# EasyEDA Pro project mousring.eprj

# Schematic final
Board Name: c2; Create Date: 2025-06-27; Page Name: P1; Project Name: mousring; Schematic Name: final; Update Date: 2025-07-08; Company: EasyEDA.com; Page Size: A4; Version: V1.0
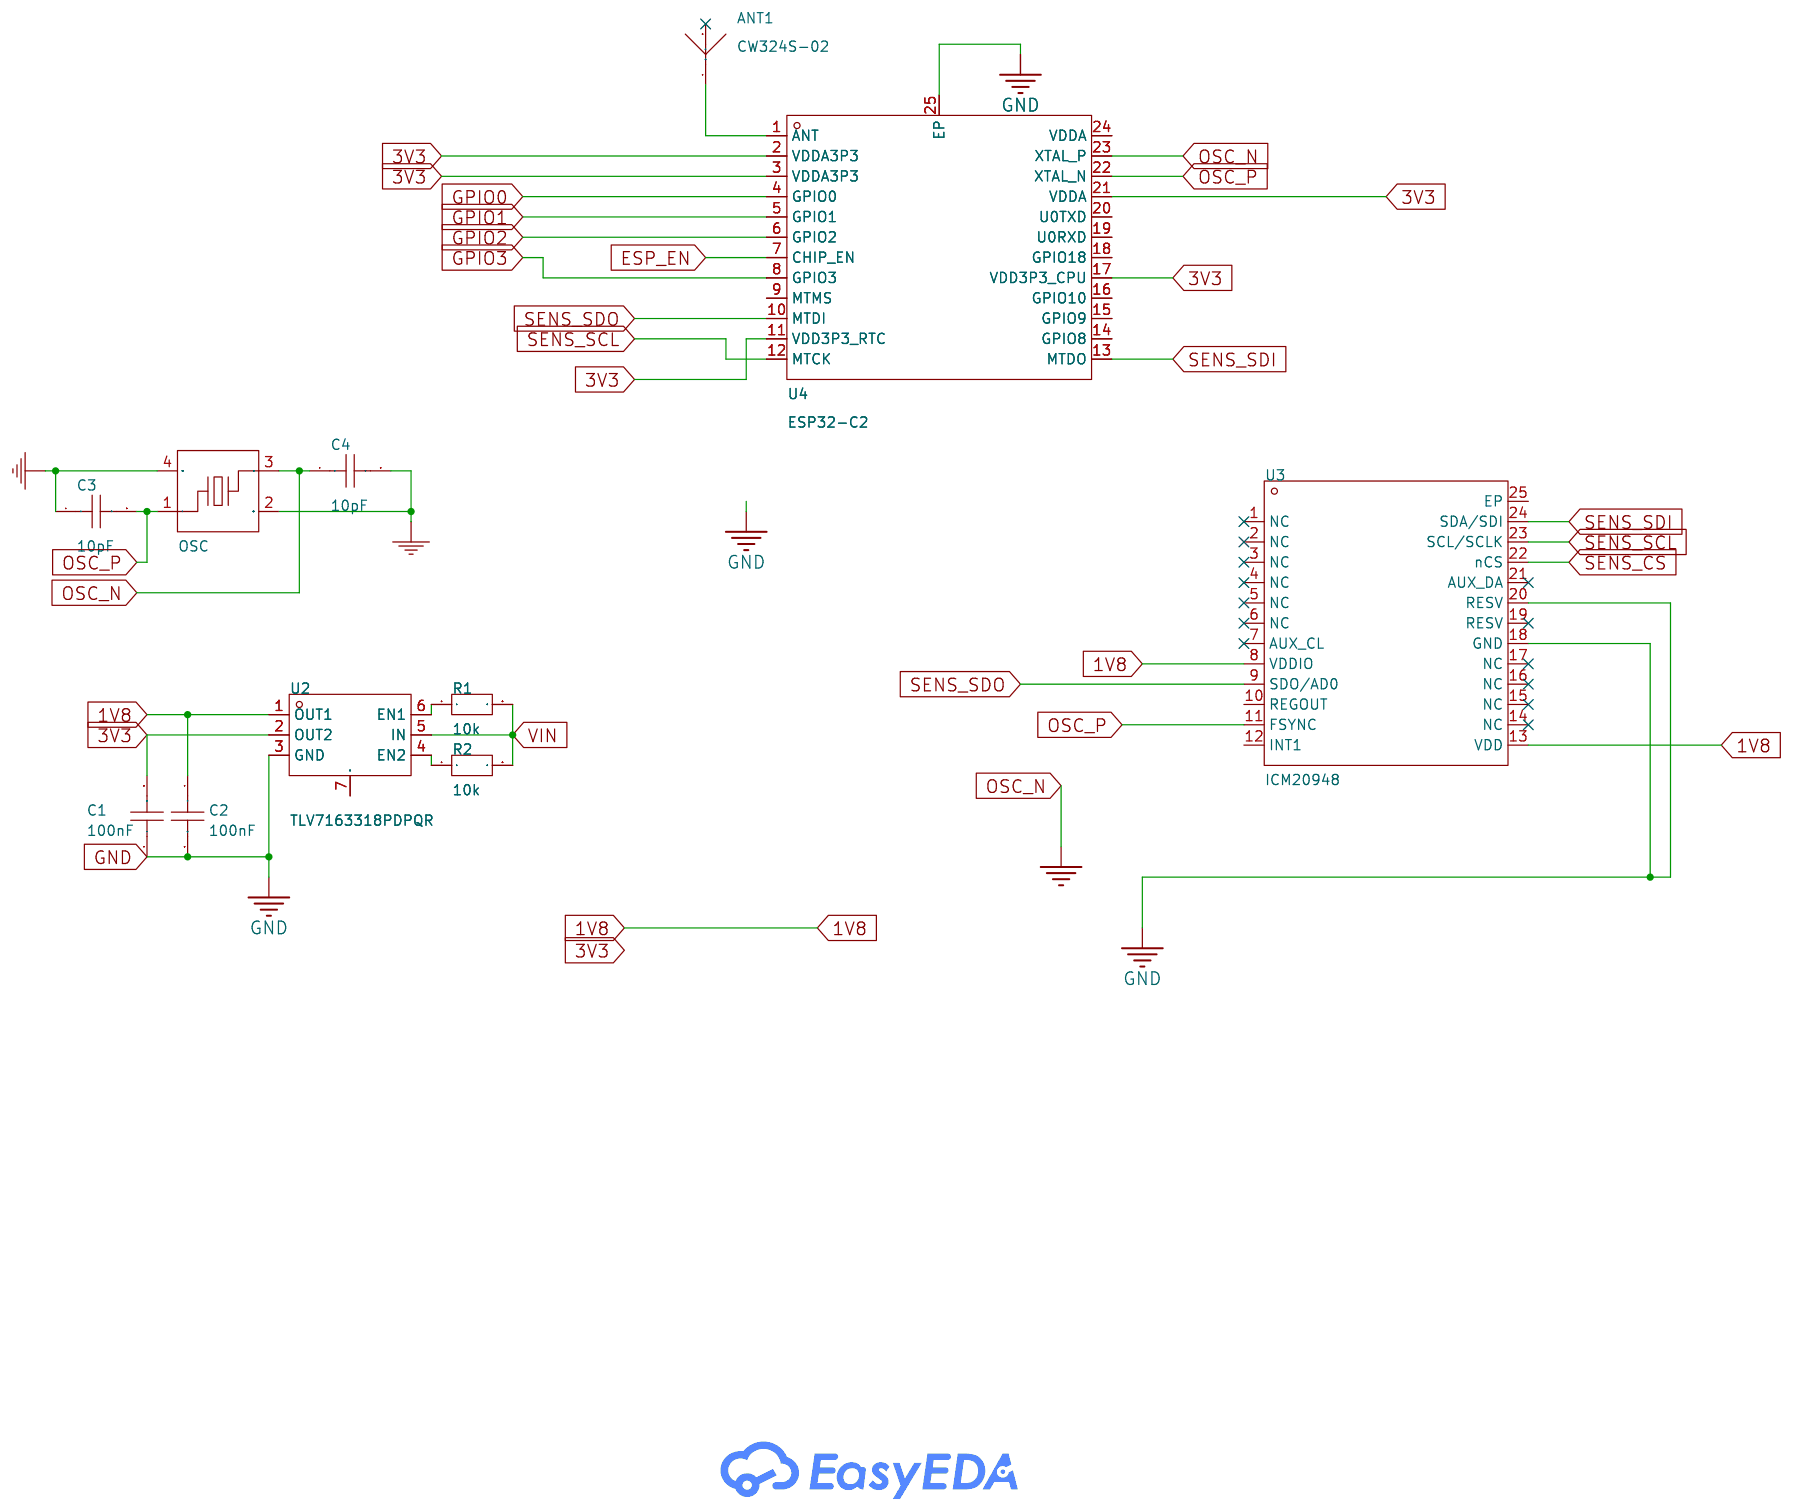
[diagram p0: schematic sheet]

## Parts
ANT1  CW324S-02  [ANT-SMD_L3.2-W1.6_CW324S-01]
C1  100nF  [C0201]
C2  100nF  [C0201]
C3  10pF  [C0201]
C4  10pF  [C0201]
R1  10k  [R0201]
R2  10k  [R0201]
U2  TLV7163318PDPQR  [XDFN-6_L1.2-W1.2-P0.40-BL-EP]
U3  ICM20948  [QFN-24_L3.0-W3.0-P0.40-BL-EP]
U4  ESP32-C2  [QFN-24_L4.0-W4.0-P0.50-BL-EP2.8]
X1  OSC  [CRYSTAL-SMD_4P-L1.6-W1.2-BL]

## Library data of the parts
ANT1 = CW324S-02: LCSC Part Name: LXC(连兴创)陶瓷SMT天线-CW324S; Supplier Part: C42379500; Manufacturer: LXC(连兴创); Datasheet: https://atta.szlcsc.com/upload/public/pdf/source/20241122/8212D1C9576862F7E470A8A9A6B7A996.pdf; Supplier: LCSC
C1-C4 = C0201X5R104K100NTA: LCSC Part Name: 100nF ±10% 10V; Supplier Part: C115574; Manufacturer: EYANG(宇阳科技); Supplier Footprint: 0201; JLCPCB Part Class: Extended Part; Datasheet: https://atta.szlcsc.com/upload/public/pdf/source/20190320/C377537_BBE5FC54ADCBA21EA65467531FECB98A.pdf; Supplier: LCSC; Tolerance: ±10%; Voltage Rating: 10V; Temperature Coefficient: X5R
R1 R2 = CRCW0201174KFKED: LCSC Part Name: 厚膜电阻 174kΩ ±1% 50mW; Supplier Part: C4009760; Manufacturer: VISHAY(威世); Supplier Footprint: 0201; JLCPCB Part Class: Extended Part; Datasheet: https://atta.szlcsc.com/upload/public/pdf/source/20231212/8E026970A8D15C23141671AA58BF5AA2.pdf; Supplier: LCSC; Type: Thick Film Resistor; Tolerance: ±1%; Power(Watts): 50mW; Temperature Coefficient: ±100ppm/℃; Operating Temperature: -55℃~+155℃
U2 = TLV7163318PDPQR: LCSC Part Name: 具有使能功能的 150mA、双通道低压降稳压器; Supplier Part: C2859836; Manufacturer: TI(德州仪器); Supplier Footprint: X2SON-6(1.2x1.2); JLCPCB Part Class: Extended Part; Datasheet: https://www.ti.com/cn/lit/gpn/tlv716p; Supplier: LCSC; Output Type: Fixed; Maximum Input Voltage: 5.5V; Output Voltage: 1.8V；3.3V; Output Current: 150mA; Dropout Voltage: 580mV@(150mA)；420mV@(150mA); standby current: 75uA; Feature: ESD Protection；Surge Protection；Automatic Discharge Function；Thermal Protection(TSD)；Under-voltage Lockout；Overcurrent Protection(OCP)；With ability；Anti-Siphon; Operating Temperature: -40℃~+125℃@(Tj); Output Polarity: Positive electrode; Number of Outputs: 2
U3 = ICM20948: Supplier Part: C2683596; Supplier Footprint: DFN-24-EP(3.0x3.0); JLCPCB Part Class: Extended Part; Supplier: LCSC
U4 = ESP32-C2: Supplier Part: C9900029065; Supplier Footprint: QFN24; Supplier: LCSC
X1 = 40MHz: Supplier: LCSC; Supplier Part: C7301927; Manufacturer: SCTF(星通时频); Manufacturer Part: SX0B40.000F1010F30; JLCPCB Part Class: Extended Part; nameAlias: Value; Contributor: lcsc; spicePre: X; spiceSymbolName: SX0B40.000F1010F30

## Nets
1V8: C2.1 U2.1(OUT1) U3.8(VDDIO) U3.13(VDD)
3V3: C1.2 U2.2(OUT2) U4.2(VDDA3P3) U4.3(VDDA3P3) U4.11(VDD3P3_RTC) U4.17(VDD3P3_CPU) U4.21(VDDA)
GND: C1.1 C2.2 C3.1 C4.2 U2.3(GND) U3.18(GND) U3.20(RESV) U4.25(EP) X1.2(GND) X1.4(GND)
VIN: R1.2 R2.2 U2.5(IN)
ESP_EN: U4.7(CHIP_EN)
GPIO0: U4.4(GPIO0)
GPIO1: U4.5(GPIO1)
GPIO2: U4.6(GPIO2)
GPIO3: U4.8(GPIO3)
OSC_N: C4.1 U4.23(XTAL_P) X1.3
OSC_P: C3.2 U3.11(FSYNC) U4.22(XTAL_N) X1.1
SENS_CS: U3.22(nCS)
SENS_SCL: U3.23(SCL/SCLK) U4.12(MTCK)
SENS_SDI: U3.24(SDA/SDI) U4.13(MTDO)
SENS_SDO: U3.9(SDO/AD0) U4.10(MTDI)
$1N3310: ANT1.1(ANT) U4.1(ANT)
$1N5722: R2.1 U2.4(EN2)
$1N5750: R1.1 U2.6(EN1)

Not connected (* = marked no-connect by the designer): ANT1 2*; U2 7(EP); U3 1(NC)* 2(NC)* 3(NC)* 4(NC)* 5(NC)* 6(NC)* 7(AUX_CL)* 10(REGOUT) 12(INT1) 14(NC)* 15(NC)* 16(NC)* 17(NC)* 19(RESV)* 21(AUX_DA)* 25(EP); U4 9(MTMS) 14(GPIO8) 15(GPIO9) 16(GPIO10) 18(GPIO18) 19(U0RXD) 20(U0TXD) 24(VDDA)

# Schematic ldo
Board Name: ldo; Create Date: 2025-06-27; Page Name: P1; Project Name: mousring; Schematic Name: ldo; Update Date: 2025-06-27; Company: EasyEDA.com; Page Size: A4; Version: V1.0
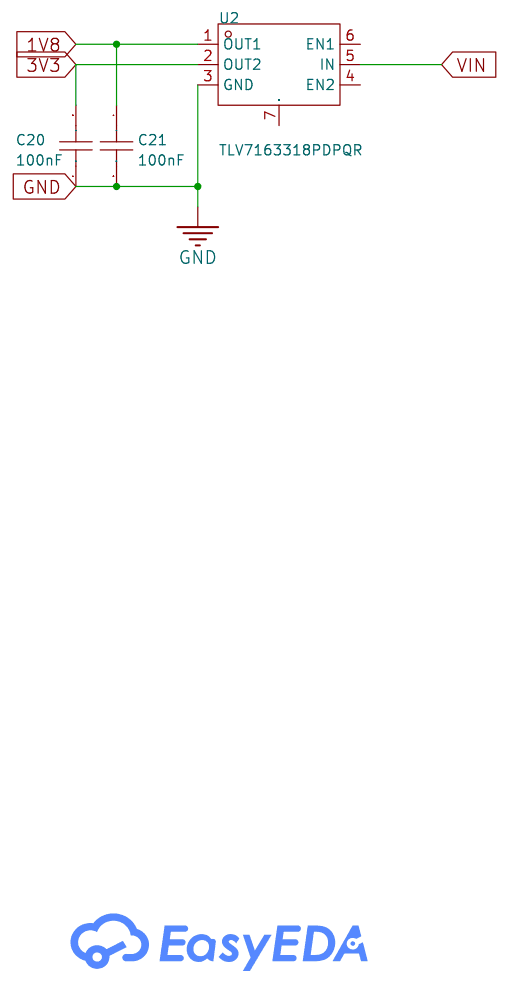
[diagram p1: schematic sheet]

## Parts
C20  100nF  [C0201]
C21  100nF  [C0201]
U2  TLV7163318PDPQR  [XDFN-6_L1.2-W1.2-P0.40-BL-EP]

## Library data of the parts
C20 C21 = C0201X5R104K100NTA: LCSC Part Name: 100nF ±10% 10V; Supplier Part: C115574; Manufacturer: EYANG(宇阳科技); Supplier Footprint: 0201; JLCPCB Part Class: Extended Part; Datasheet: https://atta.szlcsc.com/upload/public/pdf/source/20190320/C377537_BBE5FC54ADCBA21EA65467531FECB98A.pdf; Supplier: LCSC; Tolerance: ±10%; Voltage Rating: 10V; Temperature Coefficient: X5R
U2 = TLV7163318PDPQR: LCSC Part Name: 具有使能功能的 150mA、双通道低压降稳压器; Supplier Part: C2859836; Manufacturer: TI(德州仪器); Supplier Footprint: X2SON-6(1.2x1.2); JLCPCB Part Class: Extended Part; Datasheet: https://www.ti.com/cn/lit/gpn/tlv716p; Supplier: LCSC; Output Type: Fixed; Maximum Input Voltage: 5.5V; Output Voltage: 1.8V；3.3V; Output Current: 150mA; Dropout Voltage: 580mV@(150mA)；420mV@(150mA); standby current: 75uA; Feature: ESD Protection；Surge Protection；Automatic Discharge Function；Thermal Protection(TSD)；Under-voltage Lockout；Overcurrent Protection(OCP)；With ability；Anti-Siphon; Operating Temperature: -40℃~+125℃@(Tj); Output Polarity: Positive electrode; Number of Outputs: 2

## Nets
1V8: C21.1 U2.1(OUT1)
3V3: C20.2 U2.2(OUT2)
GND: C20.1 C21.2 U2.3(GND)
VIN: U2.5(IN)

Not connected (* = marked no-connect by the designer): U2 4(EN2) 6(EN1) 7(EP)

# Schematic h4
Board Name: h4; Create Date: 2025-07-08; Page Name: h4; Project Name: mousring; Schematic Name: h4; Update Date: 2025-07-26; Company: EasyEDA.com; Page Size: A4; Version: V1.0
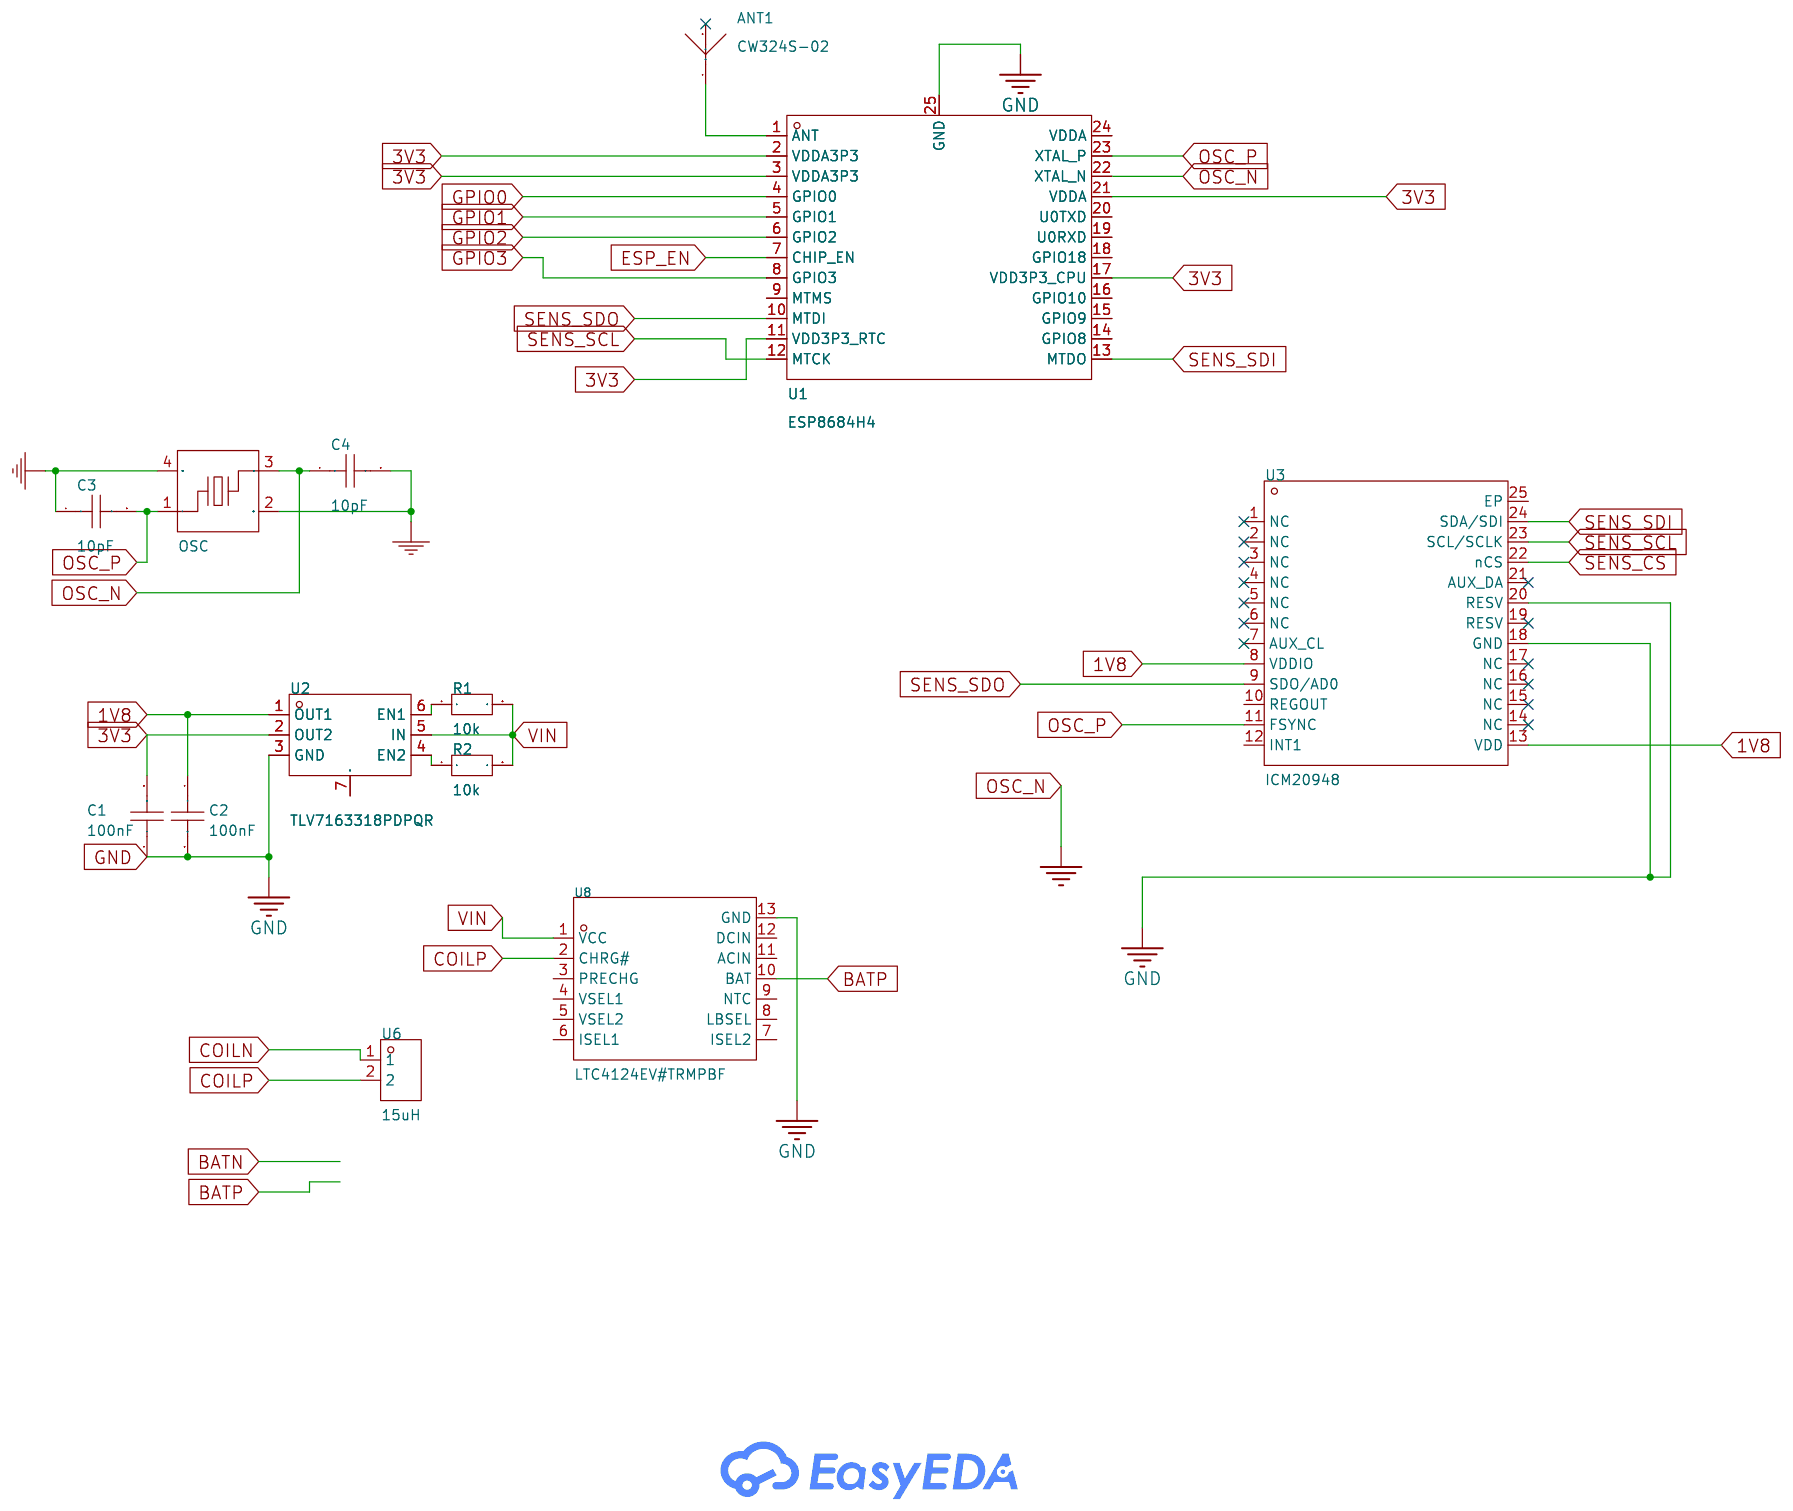
[diagram p2: schematic sheet]

## Parts
ANT1  CW324S-02  [ANT-SMD_L3.2-W1.6_CW324S-01]
C1  100nF  [C0201]
C2  100nF  [C0201]
C3  10pF  [C0201]
C4  10pF  [C0201]
R1  10k  [R0201]
R2  10k  [R0201]
U1  ESP8684H4  [QFN-24_L4.0-W4.0-P0.50-TL-EP2.8]
U2  TLV7163318PDPQR  [XDFN-6_L1.2-W1.2-P0.40-BL-EP]
U3  ICM20948  [QFN-24_L3.0-W3.0-P0.40-BL-EP]
U6  15uH  [newcoil]
U8  LTC4124EV#TRMPBF  [LQFN-12_L2.0-W2.0-P0.50-TL-EP0.7-1]
X1  OSC  [CRYSTAL-SMD_4P-L1.6-W1.2-BL]

## Library data of the parts
ANT1 = CW324S-02: LCSC Part Name: LXC(连兴创)陶瓷SMT天线-CW324S; Supplier Part: C42379500; Manufacturer: LXC(连兴创); Datasheet: https://atta.szlcsc.com/upload/public/pdf/source/20241122/8212D1C9576862F7E470A8A9A6B7A996.pdf; Supplier: LCSC
C1-C4 = C0201X5R104K100NTA: LCSC Part Name: 100nF ±10% 10V; Supplier Part: C115574; Manufacturer: EYANG(宇阳科技); Supplier Footprint: 0201; JLCPCB Part Class: Extended Part; Datasheet: https://atta.szlcsc.com/upload/public/pdf/source/20190320/C377537_BBE5FC54ADCBA21EA65467531FECB98A.pdf; Supplier: LCSC; Tolerance: ±10%; Voltage Rating: 10V; Temperature Coefficient: X5R
R1 R2 = CRCW0201174KFKED: LCSC Part Name: 厚膜电阻 174kΩ ±1% 50mW; Supplier Part: C4009760; Manufacturer: VISHAY(威世); Supplier Footprint: 0201; JLCPCB Part Class: Extended Part; Datasheet: https://atta.szlcsc.com/upload/public/pdf/source/20231212/8E026970A8D15C23141671AA58BF5AA2.pdf; Supplier: LCSC; Type: Thick Film Resistor; Tolerance: ±1%; Power(Watts): 50mW; Temperature Coefficient: ±100ppm/℃; Operating Temperature: -55℃~+155℃
U1 = ESP8684H4: Frequency Range:2.412GHz~2.484GHz Frequency Range:2.412GHz~2.484GHz Interface:ADC；SPI；I2C；PWM；UART Voltage - Supply:3V~3.6V Voltage - Supply:3V~3.6V Applications:WiFi；Bluetooth Output Power:21.5dBm Data Rate:72.2Mbps Current Of Transmitting:370mA Sensitiv; Supplier Part: C3013914; Manufacturer: ESPRESSIF(乐鑫); Supplier Footprint: SMD; JLCPCB Part Class: Extended Part; Datasheet: https://atta.szlcsc.com/upload/public/pdf/source/20241030/0403F47588ED3144E213BDA8AAC70CC1.pdf; Supplier: LCSC; Frequency Range: 2.412GHz~2.484GHz; Interface: ADC；SPI；I2C；PWM；UART; Voltage - Supply: 3V~3.6V; Applications: WiFi；Bluetooth; Output Power: 21.5dBm; Data Rate: 72.2Mbps; Current Of Transmitting: 370mA; Sensitivity: -99dBm; Receive Current: 65mA; Typical Application Frequency: 2.4GHz; Operating Temperature: -40℃~+105℃
U2 = TLV7163318PDPQR: LCSC Part Name: 具有使能功能的 150mA、双通道低压降稳压器; Supplier Part: C2859836; Manufacturer: TI(德州仪器); Supplier Footprint: X2SON-6(1.2x1.2); JLCPCB Part Class: Extended Part; Datasheet: https://www.ti.com/cn/lit/gpn/tlv716p; Supplier: LCSC; Output Type: Fixed; Maximum Input Voltage: 5.5V; Output Voltage: 1.8V；3.3V; Output Current: 150mA; Dropout Voltage: 580mV@(150mA)；420mV@(150mA); standby current: 75uA; Feature: ESD Protection；Surge Protection；Automatic Discharge Function；Thermal Protection(TSD)；Under-voltage Lockout；Overcurrent Protection(OCP)；With ability；Anti-Siphon; Operating Temperature: -40℃~+125℃@(Tj); Output Polarity: Positive electrode; Number of Outputs: 2
U3 = ICM20948: Supplier Part: C2683596; Supplier Footprint: DFN-24-EP(3.0x3.0); JLCPCB Part Class: Extended Part; Supplier: LCSC
U6 = YX-A11-R500800-R0890: Supplier Part: C3003210; Manufacturer: CND-tek(磁联达); JLCPCB Part Class: Extended Part; Datasheet: https://atta.szlcsc.com/upload/public/pdf/source/20220506/4D0CC8BB7166D52E801353293D8C1412.pdf; Supplier: LCSC; Function: Transmitter; Tolerance: ±10%; Number of Coils: Single coil, single layer; Operating Temperature: -40℃~+85℃
U8 = LTC4124EV#TRMPBF: LCSC Part Name: 100mA 无线锂离子充电器带低电量断开功能; Supplier Part: C3682877; Manufacturer: ADI(亚德诺); Supplier Footprint: LQFN-12(2x2); JLCPCB Part Class: Extended Part; Datasheet: https://atta.szlcsc.com/upload/public/pdf/source/20231009/7EC994927F1848793EB29D91CD0599CA.pdf; Supplier: LCSC; The Chip Type: Charging IC; Voltage - Supply: 2.7V~5.5V; Charge Current - Max: 100mA; Charging Saturation Voltage: 4.35V; End-Off Voltage: 2.7V; Type of Battery: Lithium Battery; Number of Cells: 1; Operating Temperature: -20℃~+85℃; Battery Temperature Detection: Support; 0V Battery Charge: Not Supported; Supply Current (Iq): 120uA
X1 = 40MHz: Supplier: LCSC; Supplier Part: C7301927; Manufacturer: SCTF(星通时频); Manufacturer Part: SX0B40.000F1010F30; JLCPCB Part Class: Extended Part; nameAlias: Value; Contributor: lcsc; spicePre: X; spiceSymbolName: SX0B40.000F1010F30

## Nets
1V8: C2.1 U2.1(OUT1) U3.8(VDDIO) U3.13(VDD)
3V3: C1.2 U1.2(VDDA3P3) U1.3(VDDA3P3) U1.11(VDD3P3_RTC) U1.17(VDD3P3_CPU) U1.21(VDDA) U2.2(OUT2)
GND: C1.1 C2.2 C3.1 C4.2 U1.25(GND) U2.3(GND) U3.18(GND) U3.20(RESV) U8.13(GND) X1.2(GND) X1.4(GND)
VIN: R1.2 R2.2 U2.5(IN) U8.1(VCC)
BATP: U8.10(BAT)
COILN: U6.1
COILP: U6.2 U8.2(CHRG#)
ESP_EN: U1.7(CHIP_EN)
GPIO0: U1.4(GPIO0)
GPIO1: U1.5(GPIO1)
GPIO2: U1.6(GPIO2)
GPIO3: U1.8(GPIO3)
OSC_N: C4.1 U1.22(XTAL_N) X1.3
OSC_P: C3.2 U1.23(XTAL_P) U3.11(FSYNC) X1.1
SENS_CS: U3.22(nCS)
SENS_SCL: U1.12(MTCK) U3.23(SCL/SCLK)
SENS_SDI: U1.13(MTDO) U3.24(SDA/SDI)
SENS_SDO: U1.10(MTDI) U3.9(SDO/AD0)
$1N3310: ANT1.1(ANT) U1.1(ANT)
$1N5722: R2.1 U2.4(EN2)
$1N5750: R1.1 U2.6(EN1)

Not connected (* = marked no-connect by the designer): ANT1 2*; U1 9(MTMS) 14(GPIO8) 15(GPIO9) 16(GPIO10) 18(GPIO18) 19(U0RXD) 20(U0TXD) 24(VDDA); U2 7(EP); U3 1(NC)* 2(NC)* 3(NC)* 4(NC)* 5(NC)* 6(NC)* 7(AUX_CL)* 10(REGOUT) 12(INT1) 14(NC)* 15(NC)* 16(NC)* 17(NC)* 19(RESV)* 21(AUX_DA)* 25(EP); U8 3(PRECHG) 4(VSEL1) 5(VSEL2) 6(ISEL1) 7(ISEL2) 8(LBSEL) 9(NTC) 11(ACIN) 12(DCIN)

# Board PCB8
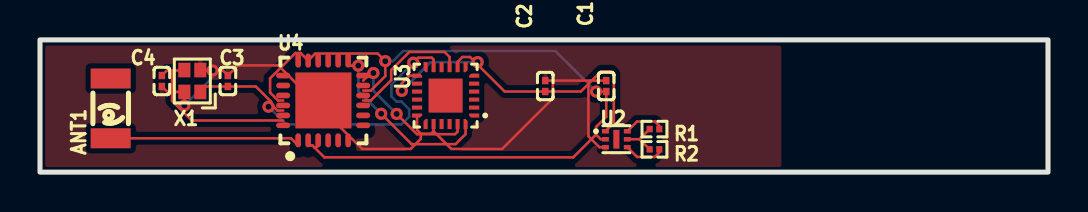
[diagram p3: board, top side]
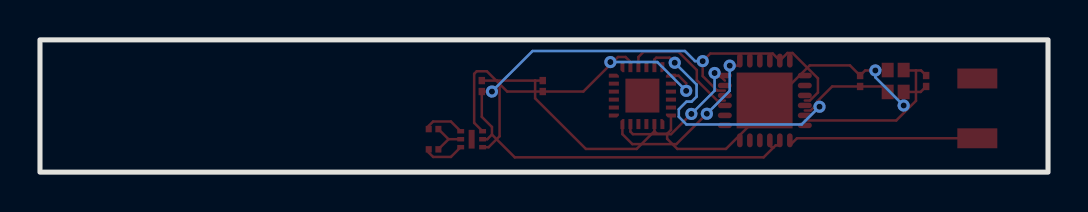
[diagram p4: board, bottom side, seen from below]

Outline 50.42 x 6.64 mm; copper layers: Top Layer, Bottom Layer. Coordinates in mm from the lower left corner of the outline.
Outline path: rectangle 0,0 50.42,6.64
Stack: Top Layer 0.012mm / Dielectric1 0.025mm FR4 er 4.5 / Bottom Layer 0.012mm

## Design rules (mm)
template: Custom Config
spacing copperThickness1oz (default): track to track 0.102, other pairs 0.152 to 0.3
spacing copperThickness2oz: track to track 0.203, other pairs 0.152 to 0.3
track width copperThickness1oz (default): min 0.127, default 0.127, max 2.54
track width copperThickness2oz: min 0.203, default 0.254, max 2.54
differential pair differentialPair (default): width min 0.127, default 0.254, max 2.54; gap min 0.152, default 0.152
via viaSize (default): diameter min 0.5, default 0.61, max 10; hole min 0.3, default 0.305, max 6.3

## Placement (name value [footprint] x y rotation side)
ANT1  CW324S-02  [ANT-SMD_L3.2-W1.6_CW324S-01]  3.54 3.2 90 top
C1  100nF  [C0201]  28.32 4.32 270 top
C2  100nF  [C0201]  25.27 4.32 90 top
C3  10pF  [C0201]  9.4 4.57 270 top
C4  10pF  [C0201]  6.1 4.57 270 top
R1  10k  [R0201]  30.73 2.16 180 top
R2  10k  [R0201]  30.73 1.14 180 top
U2  TLV7163318PDPQR  [XDFN-6_L1.2-W1.2-P0.40-BL-EP]  28.83 1.65 270 top
U3  ICM20948  [QFN-24_L3.0-W3.0-P0.40-BL-EP]  20.29 3.84 90 top
U4  ESP32-C2  [QFN-24_L4.0-W4.0-P0.50-BL-EP2.8]  14.16 3.6 0 top
X1  OSC  [CRYSTAL-SMD_4P-L1.6-W1.2-BL]  7.62 4.57 90 top

## Footprints (pads in the part's own frame, mm; a bottom-side part is the same pattern mirrored in y, then rotated)
ANT-SMD_L3.2-W1.6_CW324S-01
  rect 1x2 smd: 1(-1.5,0) 2(1.5,0)
C0201
  rect 0.368x0.324 smd: 1(-0.275,0) 2(0.275,0)
CRYSTAL-SMD_4P-L1.6-W1.2-BL
  rect 0.73x0.6 smd: 1(-0.55,-0.4) 2(0.55,-0.4) 3(0.55,0.4) 4(-0.55,0.4)
QFN-24_L3.0-W3.0-P0.40-BL-EP
  custom 0.2x0.506 smd: 1(-1,-1.427) 6(1,-1.427) 13(1,1.427) 18(-1,1.427)
  rect 0.2x0.505 smd: 2(-0.6,-1.427) 3(-0.2,-1.427) 4(0.2,-1.427) 5(0.6,-1.427) 14(0.6,1.427) 15(0.2,1.427) 16(-0.2,1.427) 17(-0.6,1.427)
  custom 0.506x0.2 smd: 7(1.427,-1) 12(1.427,1) 19(-1.427,1) 24(-1.427,-1)
  rect 0.505x0.2 smd: 8(1.427,-0.6) 9(1.427,-0.2) 10(1.427,0.2) 11(1.427,0.6) 20(-1.427,0.6) 21(-1.427,0.2) 22(-1.427,-0.2) 23(-1.427,-0.6)
  rect 1.7x1.7 smd: 25(0,0)
QFN-24_L4.0-W4.0-P0.50-BL-EP2.8
  oval 0.28x0.7 smd: 1(-1.25,-2) 2(-0.75,-2) 3(-0.25,-2) 4(0.25,-2) 5(0.75,-2) 6(1.25,-2) 13(1.25,2) 14(0.75,2) 15(0.25,2) 16(-0.25,2) 17(-0.75,2) 18(-1.25,2)
  oval 0.7x0.28 smd: 7(2,-1.25) 8(2,-0.75) 9(2,-0.25) 10(2,0.25) 11(2,0.75) 12(2,1.25) 19(-2,1.25) 20(-2,0.75) 21(-2,0.25) 22(-2,-0.25) 23(-2,-0.75) 24(-2,-1.25)
  rect 2.8x2.8 smd: 25(0.013,0)
R0201
  rect 0.303x0.324 smd: 1(-0.241,0) 2(0.241,0)
XDFN-6_L1.2-W1.2-P0.40-BL-EP
  rect 0.224x0.345 smd: 1(-0.4,-0.547) 2(0,-0.547) 3(0.4,-0.547) 4(0.4,0.547) 5(0,0.547) 6(-0.4,0.547)
  rect 0.94x0.3 smd: 7(0,0)

## Nets
As in the schematic.

Pads without a net: ANT1 2; U2 7; U3 1 2 3 4 5 6 7 10 12 14 15 16 17 19 21 25; U4 9 14 15 16 18 19 20 24

## Via types
v1: diameter 0.61, hole 0.305, Top Layer to Bottom Layer, 12 vias

## Routing (per net, layer and track width the routed paths; a pad name or vN(x,y) marks a point on that pad's centre or on a via; arc(x,y) is an arc through that point)
1V8: length 18.2
  Top Layer w0.127: 21.76,5.52 v1(21.89,5.52) ; 21.76,5.52 21.51,5.78 21.13,5.78 20.89,5.53 U3.8 ; 21.76,5.52 23.24,4.04 C2.1 27.05,4.04 28.07,5.06 28.57,5.06 28.7,4.93 28.7,2.47 U2.1 ; U3.13 18.48,4.84 18.1,4.46 v1(18.1,4.08)
  Bottom Layer w0.127: v1(18.1,4.08) 19.54,5.52 v1(21.89,5.52)
3V3: length 41.1
  Top Layer w0.127: U4.17 13.03,5.98 12.78,5.98 11.51,4.71 11.51,3.99 11.91,3.59 12.16,3.59 ; U4.17 13.41,5.34 ; U4.17 13.77,5.95 16.89,5.95 v1(17.27,5.57) 17.27,4.82 16.54,4.09 16.16,4.09 ; 13.91,1.34 13.82,1.25 13.72,1.25 ; v1(27.81,4.04) C1.2 28.32,2.77 27.81,2.27 27.81,1.88 ; 13.41,1.34 13.62,1.34 13.72,1.25 ; 13.72,1.25 14.22,0.74 26.67,0.74 27.81,1.88 ; 27.81,1.88 28.05,1.65 U2.2
  Bottom Layer w0.127: v1(17.27,5.57) 17.65,5.57 18.16,6.08 25.78,6.08 v1(27.81,4.04)
GND: length 35.1
  Top Layer w0.127: 27.56,4.59 27.43,4.47 27.43,1.8 27.98,1.25 U2.3 ; 27.56,4.59 C1.1 ; 27.56,4.59 25.65,4.59 ; 25.65,4.59 C2.2 ; 25.65,4.59 25.65,3.7 23.11,1.16 20.57,1.16 19.69,2.05 ; C4.2 6.37,4.02 X1.4 v1(7.22,3.34) ; X1.2 8.04,5.1 v1(8.64,5.1) 9.14,5.1 C3.1 9.91,5.35 11.92,5.35 16.11,1.16 18.54,1.16 19.05,1.67 19.05,1.93 ; 19.05,1.93 18.86,2.11 U3.18 ; 19.05,1.93 19.56,1.93 19.69,2.05 ; 19.69,2.05 19.69,2.41
  Bottom Layer w0.127: v1(8.64,5.1) 8.64,4.76 v1(7.22,3.34)
VIN: length 2
  Top Layer w0.127: 29.98,1.65 R2.2 ; 29.98,1.65 U2.5 ; 29.98,1.65 R1.2
OSC_N: length 8.7
  Top Layer w0.127: 12.16,2.59 7.59,2.59 6.6,3.58 6.6,5.1 ; 6.6,5.1 6.35,5.1 C4.1 ; 6.6,5.1 7.2,5.1 X1.3
OSC_P: length 17.8
  Top Layer w0.127: v1(18.67,5.49) 18.93,5.74 19.59,5.74 19.69,5.65 U3.11 ; X1.1 8.3,4.3 C3.2 10.79,4.3 11.56,3.54 11.56,3.41 ; 11.56,3.41 11.87,3.09 12.16,3.09 ; 11.56,3.41 v1(11.43,3.28)
  Bottom Layer w0.127: v1(18.67,5.49) 17.58,4.39 17.58,3.79 17.83,3.54 18.08,3.54 18.46,3.15 18.46,2.77 18.08,2.39 12.32,2.39 v1(11.43,3.28)
SENS_SCL: length 7.1
  Top Layer w0.127: 16.16,4.59 16.54,4.97 v1(16.68,4.97) ; v1(17.84,2.92) 18.86,1.9 20.76,1.9 20.89,2.03 U3.23
  Bottom Layer w0.127: v1(17.84,2.92) 16.68,4.08 v1(16.68,4.97)
SENS_SDI: length 9
  Top Layer w0.127: v1(17.06,2.93) 18.59,1.4 20.79,1.4 21.29,1.9 U3.24 ; 15.41,5.34 v1(15.92,5.34)
  Bottom Layer w0.127: v1(15.92,5.34) 15.92,4.07 v1(17.06,2.93)
SENS_SDO: length 6.2
  Top Layer w0.127: U3.9 20.49,5.78 20.23,6.03 18.47,6.03 17.57,5.12 17.57,4.61 16.54,3.59 16.16,3.59
$1N3310: length 9.5
  Top Layer w0.127: 12.91,1.34 12.56,1.7 ANT1.1
$1N5722: length 2.1
  Top Layer w0.127: R2.1 30.98,0.98 30.75,0.76 29.87,0.76 U2.4
$1N5750: length 2.1
  Top Layer w0.127: R1.1 30.98,2.32 30.75,2.54 29.87,2.54 U2.6

## Copper pours and planes (outline as drawn; the poured copper is in the pictures)
GND on Top Layer: 0.25,6.35 37.08,6.35 37.08,0.25 0.25,0.25

# Board PCB8_1
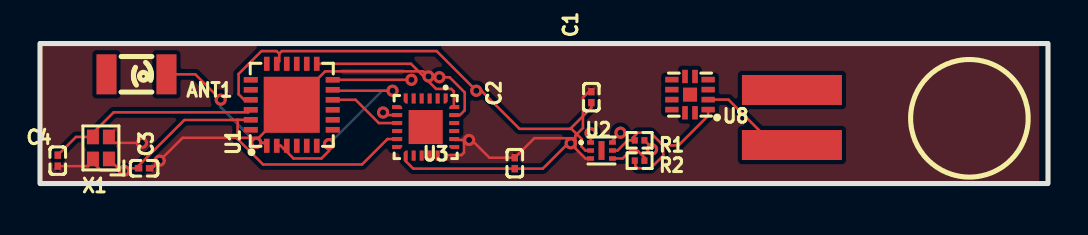
[diagram p5: board, top side]
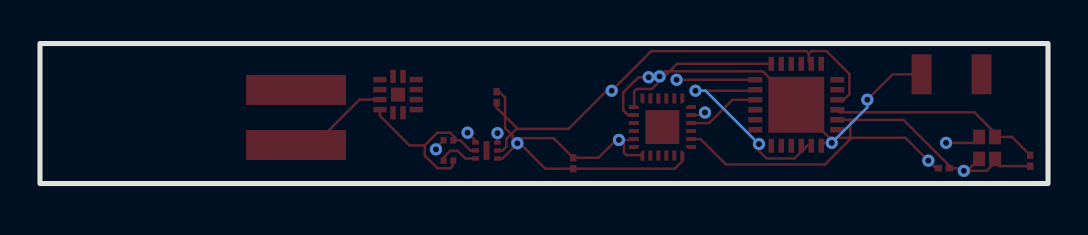
[diagram p6: board, bottom side, seen from below]

Outline 50.42 x 7 mm; copper layers: Top Layer, Inner1, Inner2, Bottom Layer. Coordinates in mm from the lower left corner of the outline.
Outline path: rectangle 0,0 50.42,7
Stack: Top Layer 0.035mm / Dielectric1 0.48mm PP er 4.5 / Inner1 0.035mm / Dielectric2 0.48mm FR4 er 4.5 / Inner2 0.035mm / Dielectric3 0.48mm PP er 4.5 / Bottom Layer 0.035mm

## Design rules (mm)
template: Custom Config
spacing copperThickness1oz (default): track to track 0.102, other pairs 0.152 to 0.3
spacing copperThickness2oz: track to track 0.203, other pairs 0.152 to 0.3
track width copperThickness1oz (default): min 0.127, default 0.127, max 2.54
track width copperThickness2oz: min 0.203, default 0.254, max 2.54
differential pair differentialPair (default): width min 0.127, default 0.254, max 2.54; gap min 0.152, default 0.152
via viaSize (default): diameter min 0.5, default 0.61, max 10; hole min 0.3, default 0.305, max 6.3
net GND uses copperRegion1

## Placement (name value [footprint] x y rotation side)
ANT1  CW324S-02  [ANT-SMD_L3.2-W1.6_CW324S-01]  4.83 5.46 180 top
C1  100nF  [C0201]  27.58 4.32 270 top
C2  100nF  [C0201]  23.75 1.02 90 top
C3  10pF  [C0201]  5.21 0.76 180 top
C4  10pF  [C0201]  0.89 1.14 270 top
R1  10k  [R0201]  29.99 2.16 180 top
R2  10k  [R0201]  29.99 1.14 180 top
U1  ESP8684H4  [QFN-24_L4.0-W4.0-P0.50-TL-EP2.8]  12.59 3.94 90 top
U2  TLV7163318PDPQR  [XDFN-6_L1.2-W1.2-P0.40-BL-EP]  28.09 1.65 270 top
U3  ICM20948  [QFN-24_L3.0-W3.0-P0.40-BL-EP]  19.29 2.82 180 top
U6  15uH  [newcoil]  42.16 3.3 270 top
U8  LTC4124EV#TRMPBF  [LQFN-12_L2.0-W2.0-P0.50-TL-EP0.7-1]  32.51 4.45 180 top
X1  OSC  [CRYSTAL-SMD_4P-L1.6-W1.2-BL]  3.05 1.78 90 top

## Footprints (pads in the part's own frame, mm; a bottom-side part is the same pattern mirrored in y, then rotated)
ANT-SMD_L3.2-W1.6_CW324S-01
  rect 1x2 smd: 1(-1.5,0) 2(1.5,0)
C0201
  rect 0.368x0.324 smd: 1(-0.275,0) 2(0.275,0)
CRYSTAL-SMD_4P-L1.6-W1.2-BL
  rect 0.73x0.6 smd: 1(-0.55,-0.4) 2(0.55,-0.4) 3(0.55,0.4) 4(-0.55,0.4)
LQFN-12_L2.0-W2.0-P0.50-TL-EP0.7-1
  rect 0.665x0.28 smd: 1(-0.907,0.75) 2(-0.907,0.25) 3(-0.907,-0.25) 4(-0.907,-0.75) 7(0.907,-0.75) 8(0.907,-0.25) 9(0.907,0.25) 10(0.907,0.75)
  rect 0.28x0.665 smd: 5(-0.25,-0.907) 6(0.25,-0.907) 11(0.25,0.907) 12(-0.25,0.907)
  rect 0.7x0.7 smd: 13(0,0)
newcoil
  rect 1.5x5 smd: 1(-1.375,-4.554) 2(1.377,-4.555)
QFN-24_L3.0-W3.0-P0.40-BL-EP
  custom 0.2x0.506 smd: 1(-1,-1.427) 6(1,-1.427) 13(1,1.427) 18(-1,1.427)
  rect 0.2x0.505 smd: 2(-0.6,-1.427) 3(-0.2,-1.427) 4(0.2,-1.427) 5(0.6,-1.427) 14(0.6,1.427) 15(0.2,1.427) 16(-0.2,1.427) 17(-0.6,1.427)
  custom 0.506x0.2 smd: 7(1.427,-1) 12(1.427,1) 19(-1.427,1) 24(-1.427,-1)
  rect 0.505x0.2 smd: 8(1.427,-0.6) 9(1.427,-0.2) 10(1.427,0.2) 11(1.427,0.6) 20(-1.427,0.6) 21(-1.427,0.2) 22(-1.427,-0.2) 23(-1.427,-0.6)
  rect 1.7x1.7 smd: 25(0,0)
QFN-24_L4.0-W4.0-P0.50-TL-EP2.8
  rect 0.7x0.28 smd: 1(-2.05,1.25) 2(-2.05,0.75) 3(-2.05,0.25) 4(-2.05,-0.25) 5(-2.05,-0.75) 6(-2.05,-1.25) 13(2.05,-1.25) 14(2.05,-0.75) 15(2.05,-0.25) 16(2.05,0.25) 17(2.05,0.75) 18(2.05,1.25)
  rect 0.28x0.7 smd: 7(-1.25,-2.05) 8(-0.75,-2.05) 9(-0.25,-2.05) 10(0.25,-2.05) 11(0.75,-2.05) 12(1.25,-2.05) 19(1.25,2.05) 20(0.75,2.05) 21(0.25,2.05) 22(-0.25,2.05) 23(-0.75,2.05) 24(-1.25,2.05)
  rect 2.8x2.8 smd: 25(0,0)
R0201
  rect 0.303x0.324 smd: 1(-0.241,0) 2(0.241,0)
XDFN-6_L1.2-W1.2-P0.40-BL-EP
  rect 0.224x0.345 smd: 1(-0.4,-0.547) 2(0,-0.547) 3(0.4,-0.547) 4(0.4,0.547) 5(0,0.547) 6(-0.4,0.547)
  rect 0.94x0.3 smd: 7(0,0)

## Nets
As in the schematic.

Pads without a net: ANT1 2; U1 9 14 15 16 18 19 20 24; U2 7; U3 1 2 3 4 5 6 7 10 12 14 15 16 17 19 21 25; U8 3 4 5 6 7 8 9 11 12

## Via types
v1: diameter 0.61, hole 0.305, Top Layer to Bottom Layer, 17 vias

## Routing (per net, layer and track width the routed paths; a pad name or vN(x,y) marks a point on that pad's centre or on a via; arc(x,y) is an arc through that point)
1V8: length 21.7
  Top Layer w0.127: v1(27.54,2.52) U2.1 ; U3.13 18.29,1.12 18.67,0.74 C2.1 25.15,0.74 26.42,2.01 v1(26.54,2.01) ; U3.8 17.29,3.42 v1(17.16,3.55)
  Inner1 w0.127: v1(27.54,2.52) 27.03,2.01 v1(26.54,2.01)
  Inner2 w0.127: v1(17.16,3.55) 18.7,2.01 v1(26.54,2.01)
3V3: length 39.6
  Top Layer w0.127: 11.97,6.49 11.97,6.11 U1.17 ; 11.97,6.49 12.09,6.62 19.84,6.62 v1(21.82,4.64) 22.08,4.64 23.98,2.73 26.52,2.73 ; 11.97,6.49 11.84,6.62 11.08,6.62 9.93,5.48 9.93,4.46 10.21,4.19 U1.21 ; v1(17.63,4.64) 14.69,4.64 U1.11 ; 12.17,1.76 12.21,1.76 U1.3 ; 12.17,1.76 12.04,1.89 U1.2 ; 12.17,1.76 12.68,1.25 14.08,1.25 14.46,1.63 v1(14.46,1.97) ; 26.52,2.73 27.58,3.79 C1.2 ; 26.52,2.73 26.58,2.73 27.09,2.23 27.09,1.84 27.28,1.65 U2.2
  Inner2 w0.127: v1(21.82,4.64) v1(17.63,4.64)
  Bottom Layer w0.127: v1(14.46,1.97) 17.12,4.64 v1(17.63,4.64)
GND: length 41.4
  Top Layer w0.127: 2.69,1.14 2.41,0.87 C4.2 ; 2.69,1.14 2.81,1.02 2.81,0.89 3.07,0.64 v1(4.21,0.64) ; 2.69,1.14 2.69,1.19 X1.4 ; U3.20 20.76,2.18 21.21,2.18 ; v1(19.43,5.35) 19.18,5.61 14.26,5.61 U1.25 10.94,2.29 7.13,2.29 v1(5.99,1.14) 5.61,0.76 C3.1 ; 27.54,1.25 27.28,1.25 26.78,1.76 26.78,2.14 ; 26.78,2.14 26.78,2.39 27.16,2.78 27.16,4.3 27.45,4.59 C1.1 ; 26.78,2.14 26.65,2.27 24.73,2.27 C2.2 22.48,1.29 21.59,2.18 21.21,2.18 ; 21.21,2.18 21.21,1.54 21.08,1.42 20.31,1.42 U3.18 ; v1(5.1,2.03) 3.74,2.03 X1.2
  Inner2 w0.127: v1(21.46,2.18) 21.46,3.32 v1(19.43,5.35) ; v1(5.99,1.14) 5.23,1.91 ; 5.23,1.91 v1(5.1,2.03) ; 5.23,1.91 5.23,1.65 v1(4.21,0.64)
VIN: length 9
  Top Layer w0.127: R2.2 29.78,1.12 29.78,0.89 29.9,0.76 30.54,0.76 31.17,1.4 31.17,1.91 ; 31.17,1.91 30.54,2.54 29.9,2.54 29.65,2.29 29.65,2.16 ; 31.17,1.91 31.94,1.91 33.42,3.39 U8.1 ; 29.65,2.16 R1.2 ; 29.65,2.16 29.4,2.16 28.89,1.65 U2.5
COILP: length 5.1
  Top Layer w0.127: 37.61,1.92 36.71,1.92 34.44,4.2 U8.2
OSC_N: length 10.7
  Top Layer w0.127: C4.1 1.8,2.33 X1.3 2.65,2.52 3.68,3.56 10.42,3.56 U1.22
OSC_P: length 18.4
  Top Layer w0.127: 9.89,3.19 9.63,3.19 9.62,3.17 7.22,3.17 4.93,0.89 C3.2 3.91,0.76 X1.1 ; 9.89,3.19 9.89,2.22 11.16,0.95 16.11,0.95 17.38,2.22 U3.11 ; 9.89,3.19 U1.23
SENS_SCL: length 8.5
  Top Layer w0.127: U1.12 v1(18.58,5.19) ; U3.23 21.01,3.42 21.25,3.66 21.25,4.55 20.48,5.31 v1(19.98,5.31)
  Inner2 w0.127: v1(19.98,5.31) 19.85,5.19 v1(18.58,5.19)
SENS_SDI: length 8.2
  Top Layer w0.127: U3.24 20.7,3.84 20.7,4.6 20.57,4.73 19.81,4.73 18.55,5.99 U1.13
SENS_SDO: length 3.7
  Top Layer w0.127: U3.9 16.95,3.02 15.78,4.19 U1.10
$1N3310: length 6.7
  Top Layer w0.127: v1(10.82,2.03) 11.2,2.03 U1.1 ; ANT1.1 7.77,5.46 v1(9.04,4.19)
  Bottom Layer w0.127: v1(10.82,2.03) 9.04,3.81 v1(9.04,4.19)
$1N5722: length 2.1
  Top Layer w0.127: 28.63,1.25 29.14,1.25 29.52,1.63 29.9,1.63 30.23,1.3 R2.1
$1N5750: length 3.2
  Top Layer w0.127: v1(29.03,2.54) 28.63,2.14 U2.6 ; v1(30.61,1.71) 30.61,1.78 R1.1
  Inner2 w0.127: v1(29.03,2.54) 29.78,2.54 v1(30.61,1.71)

## Copper pours and planes (outline as drawn; the poured copper is in the pictures)
GND on Top Layer: 49.93,-0.13 -0.25,-0.13 -0.25,7 49.93,7
